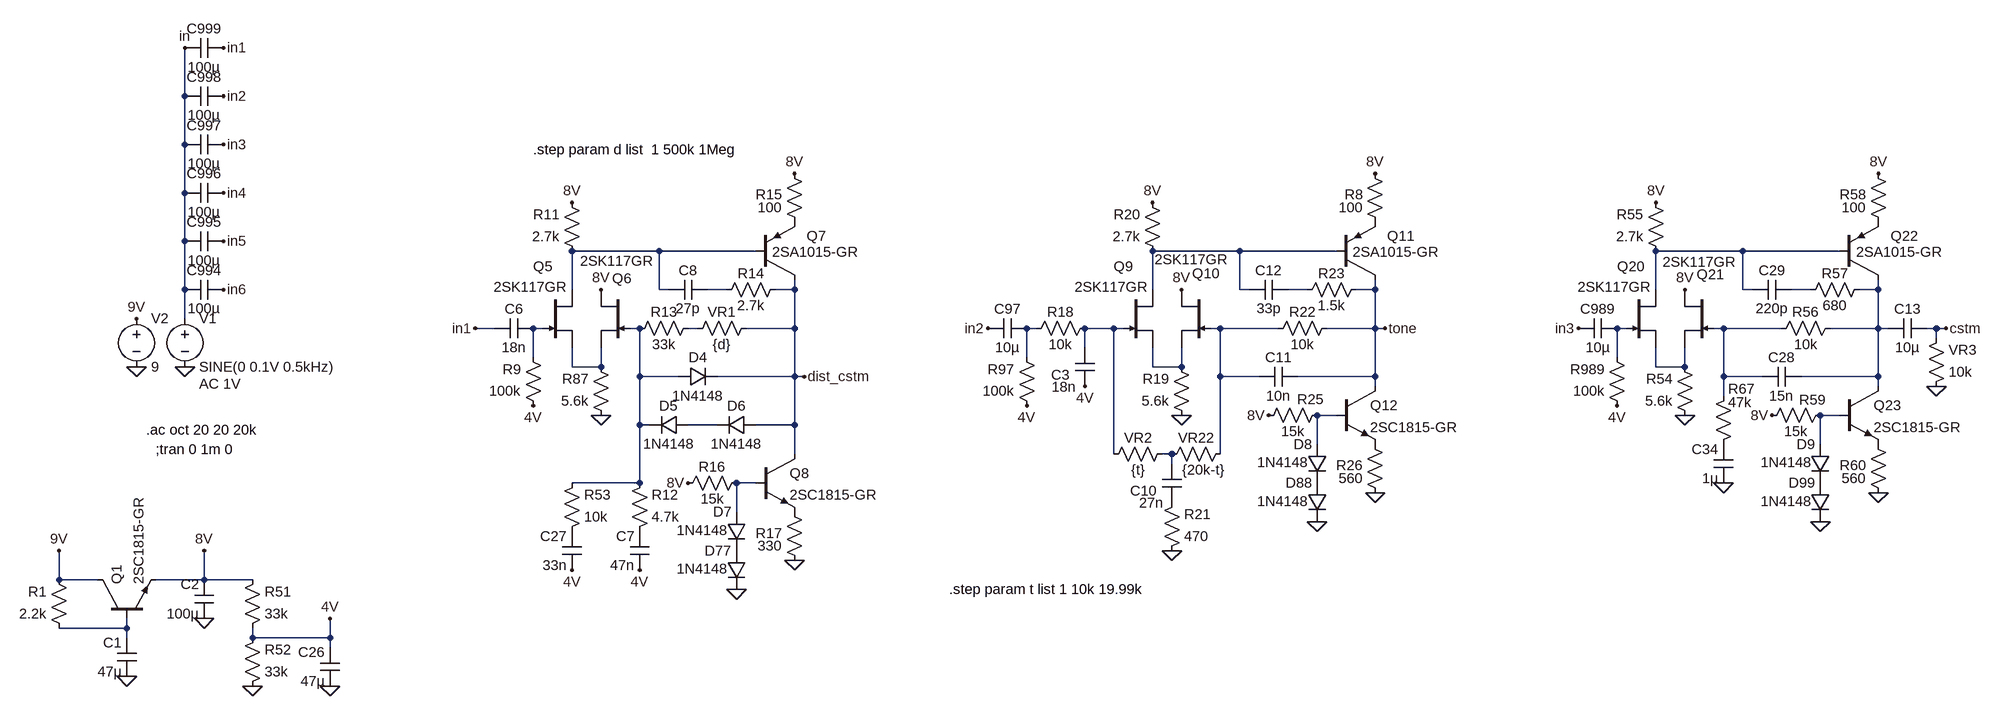
[diagram p0: schematic sd1w.asc]
sd1w.asc, the LTspice schematic file:
Version 4
SHEET 1 4260 4108
WIRE -2144 1024 -2144 944
WIRE -2144 1104 -2144 1024
WIRE -2144 1184 -2144 1104
WIRE -2144 1264 -2144 1184
WIRE -1360 1280 -1504 1280
WIRE -1200 1280 -1360 1280
WIRE -400 1280 -544 1280
WIRE -240 1280 -400 1280
WIRE 432 1280 288 1280
WIRE 592 1280 432 1280
WIRE -2144 1344 -2144 1264
WIRE -1504 1344 -1504 1280
WIRE -1360 1344 -1360 1280
WIRE -1344 1344 -1360 1344
WIRE -1248 1344 -1280 1344
WIRE -1136 1344 -1136 1328
WIRE -1136 1344 -1168 1344
WIRE -544 1344 -544 1280
WIRE -400 1344 -400 1280
WIRE -384 1344 -400 1344
WIRE -288 1344 -320 1344
WIRE -176 1344 -176 1328
WIRE -176 1344 -208 1344
WIRE 288 1344 288 1280
WIRE 432 1344 432 1280
WIRE 448 1344 432 1344
WIRE 544 1344 512 1344
WIRE 656 1344 656 1328
WIRE 656 1344 624 1344
WIRE -2144 1392 -2144 1344
WIRE -1632 1408 -1664 1408
WIRE -1552 1408 -1568 1408
WIRE -1392 1408 -1408 1408
WIRE -1296 1408 -1312 1408
WIRE -1136 1408 -1136 1344
WIRE -1136 1408 -1216 1408
WIRE -736 1408 -752 1408
WIRE -608 1408 -656 1408
WIRE -592 1408 -608 1408
WIRE -432 1408 -448 1408
WIRE -336 1408 -432 1408
WIRE -176 1408 -176 1344
WIRE -176 1408 -256 1408
WIRE -160 1408 -176 1408
WIRE 240 1408 224 1408
WIRE 400 1408 384 1408
WIRE 496 1408 400 1408
WIRE 656 1408 656 1344
WIRE 656 1408 576 1408
WIRE 672 1408 656 1408
WIRE 752 1408 736 1408
WIRE 768 1408 752 1408
WIRE 752 1424 752 1408
WIRE -656 1440 -656 1408
WIRE -1568 1456 -1568 1408
WIRE -752 1456 -752 1408
WIRE 224 1456 224 1408
WIRE -1504 1472 -1504 1440
WIRE -1456 1472 -1456 1440
WIRE -1456 1472 -1504 1472
WIRE -544 1472 -544 1440
WIRE -496 1472 -496 1440
WIRE -496 1472 -544 1472
WIRE 288 1472 288 1440
WIRE 336 1472 336 1440
WIRE 336 1472 288 1472
WIRE -1392 1488 -1392 1408
WIRE -1328 1488 -1392 1488
WIRE -1136 1488 -1136 1408
WIRE -1136 1488 -1264 1488
WIRE -1120 1488 -1136 1488
WIRE -432 1488 -432 1408
WIRE -368 1488 -432 1488
WIRE -176 1488 -176 1408
WIRE -176 1488 -304 1488
WIRE 400 1488 400 1408
WIRE 464 1488 400 1488
WIRE 656 1488 656 1408
WIRE 656 1488 528 1488
WIRE -176 1504 -176 1488
WIRE 656 1504 656 1488
WIRE 400 1520 400 1488
WIRE -240 1552 -272 1552
WIRE 592 1552 560 1552
WIRE -1392 1568 -1392 1488
WIRE -1376 1568 -1392 1568
WIRE -1264 1568 -1312 1568
WIRE -1136 1568 -1136 1488
WIRE -1136 1568 -1200 1568
WIRE -272 1600 -272 1552
WIRE 560 1600 560 1552
WIRE -1136 1616 -1136 1568
WIRE -608 1616 -608 1408
WIRE -512 1616 -528 1616
WIRE -432 1616 -432 1488
WIRE -512 1632 -512 1616
WIRE -1392 1664 -1392 1568
WIRE -1392 1664 -1504 1664
WIRE -1200 1664 -1232 1664
WIRE -1232 1712 -1232 1664
WIRE -2352 1824 -2352 1776
WIRE -2288 1824 -2352 1824
WIRE -2112 1824 -2112 1776
WIRE -2112 1824 -2192 1824
WIRE -2032 1824 -2112 1824
WIRE -2240 1904 -2240 1888
WIRE -2240 1904 -2352 1904
WIRE -2240 1920 -2240 1904
WIRE -2032 1920 -2032 1904
WIRE -1904 1920 -1904 1888
WIRE -1904 1920 -2032 1920
WIRE -1904 1936 -1904 1920
FLAG -2240 1984 0
FLAG -2112 1888 0
FLAG -2112 1776 8V
FLAG -2032 2000 0
FLAG -1904 2000 0
FLAG -1904 1888 4V
FLAG -2352 1776 9V
FLAG -1456 1552 0
FLAG -1568 1536 4V
FLAG -1456 1344 8V
FLAG -1504 1200 8V
FLAG -1136 1152 8V
FLAG -1664 1408 in1
FLAG -1312 1664 8V
FLAG -1232 1840 0
FLAG -1136 1792 0
FLAG -1392 1808 4V
FLAG -1504 1808 4V
FLAG -2144 1472 0
FLAG -2144 944 in
FLAG -2224 1472 0
FLAG -2224 1392 9V
FLAG -2080 944 in1
FLAG -2080 1024 in2
FLAG -2080 1104 in3
FLAG -2080 1184 in4
FLAG -2080 1264 in5
FLAG -2080 1344 in6
FLAG 336 1552 0
FLAG 224 1536 4V
FLAG 336 1344 8V
FLAG 288 1200 8V
FLAG 656 1152 8V
FLAG 480 1552 8V
FLAG 560 1728 0
FLAG 656 1680 0
FLAG 752 1504 0
FLAG 768 1408 cstm
FLAG 400 1664 0
FLAG -496 1552 0
FLAG -752 1536 4V
FLAG -496 1344 8V
FLAG -544 1200 8V
FLAG -176 1152 8V
FLAG -352 1552 8V
FLAG -272 1728 0
FLAG -176 1680 0
FLAG -512 1776 0
FLAG -656 1504 4V
FLAG -1120 1488 dist_cstm
FLAG -160 1408 tone
FLAG -816 1408 in2
FLAG 160 1408 in3
SYMBOL npn -2288 1888 R270
SYMATTR InstName Q1
SYMATTR Value 2SC1815-GR
SYMBOL res -2336 1920 R180
WINDOW 0 36 76 Left 2
WINDOW 3 36 40 Left 2
SYMATTR InstName R1
SYMATTR Value 2.2k
SYMBOL cap -2224 1984 R180
WINDOW 0 24 56 Left 2
WINDOW 3 24 8 Left 2
SYMATTR InstName C1
SYMATTR Value 47µ
SYMBOL cap -2096 1888 R180
WINDOW 0 24 56 Left 2
WINDOW 3 24 8 Left 2
SYMATTR InstName C2
SYMATTR Value 100µ
SYMBOL res -2048 1920 M180
WINDOW 0 36 76 Left 2
WINDOW 3 36 40 Left 2
SYMATTR InstName R51
SYMATTR Value 33k
SYMBOL res -2048 2016 M180
WINDOW 0 36 76 Left 2
WINDOW 3 36 40 Left 2
SYMATTR InstName R52
SYMATTR Value 33k
SYMBOL cap -1888 2000 R180
WINDOW 0 24 56 Left 2
WINDOW 3 24 8 Left 2
SYMATTR InstName C26
SYMATTR Value 47µ
SYMBOL res -1552 1552 R180
WINDOW 0 36 76 Left 2
WINDOW 3 36 40 Left 2
SYMATTR InstName R9
SYMATTR Value 100k
SYMBOL cap -1568 1392 R90
WINDOW 0 0 32 VBottom 2
WINDOW 3 32 32 VTop 2
SYMATTR InstName C6
SYMATTR Value 18n
SYMBOL res -1488 1296 R180
WINDOW 0 36 76 Left 2
WINDOW 3 36 40 Left 2
SYMATTR InstName R11
SYMATTR Value 2.7k
SYMBOL njf -1552 1344 R0
WINDOW 3 -81 -4 Left 2
WINDOW 0 -16 -38 Left 2
SYMATTR Value 2SK117GR
SYMATTR InstName Q5
SYMBOL njf -1408 1344 M0
WINDOW 0 -3 -18 Left 2
WINDOW 3 -39 -47 Left 2
SYMATTR InstName Q6
SYMATTR Value 2SK117GR
SYMBOL pnp -1200 1328 M180
WINDOW 0 84 73 Left 2
WINDOW 3 27 46 Left 2
SYMATTR InstName Q7
SYMATTR Value 2SA1015-GR
SYMBOL cap -1280 1328 R90
WINDOW 0 0 32 VBottom 2
WINDOW 3 32 32 VTop 2
SYMATTR InstName C8
SYMATTR Value 27p
SYMBOL res -1440 1568 R180
WINDOW 0 36 76 Left 2
WINDOW 3 36 40 Left 2
SYMATTR InstName R87
SYMATTR Value 5.6k
SYMBOL res -1152 1328 R90
WINDOW 0 5 56 VBottom 2
WINDOW 3 27 56 VTop 2
SYMATTR InstName R14
SYMATTR Value 2.7k
SYMBOL npn -1200 1616 R0
SYMATTR InstName Q8
SYMATTR Value 2SC1815-GR
SYMBOL res -1216 1648 R90
WINDOW 0 5 56 VBottom 2
WINDOW 3 27 56 VTop 2
SYMATTR InstName R16
SYMATTR Value 15k
SYMBOL diode -1216 1712 M0
WINDOW 3 30 30 Left 2
SYMATTR Value 1N4148
SYMATTR InstName D7
SYMBOL diode -1216 1776 M0
WINDOW 3 30 30 Left 2
SYMATTR Value 1N4148
SYMATTR InstName D77
SYMBOL res -1120 1808 R180
WINDOW 0 36 61 Left 2
WINDOW 3 36 40 Left 2
SYMATTR InstName R17
SYMATTR Value 330
SYMBOL res -1120 1248 R180
WINDOW 0 36 61 Left 2
WINDOW 3 36 40 Left 2
SYMATTR InstName R15
SYMATTR Value 100
SYMBOL cap -1376 1808 R180
WINDOW 0 24 56 Left 2
WINDOW 3 24 8 Left 2
SYMATTR InstName C7
SYMATTR Value 47n
SYMBOL res -1408 1760 M180
WINDOW 0 36 76 Left 2
WINDOW 3 36 40 Left 2
SYMATTR InstName R12
SYMATTR Value 4.7k
SYMBOL res -1200 1392 R90
WINDOW 0 5 56 VBottom 2
WINDOW 3 27 56 VTop 2
SYMATTR InstName VR1
SYMATTR Value {d}
SYMBOL res -1296 1392 R90
WINDOW 0 5 56 VBottom 2
WINDOW 3 27 56 VTop 2
SYMATTR InstName R13
SYMATTR Value 33k
SYMBOL diode -1328 1472 M90
WINDOW 0 0 32 VBottom 2
WINDOW 3 32 32 VTop 2
SYMATTR InstName D4
SYMATTR Value 1N4148
SYMBOL diode -1312 1552 R90
WINDOW 0 0 32 VBottom 2
WINDOW 3 32 32 VTop 2
SYMATTR InstName D5
SYMATTR Value 1N4148
SYMBOL diode -1200 1552 R90
WINDOW 0 0 32 VBottom 2
WINDOW 3 32 32 VTop 2
SYMATTR InstName D6
SYMATTR Value 1N4148
SYMBOL res -1520 1760 M180
WINDOW 0 36 76 Left 2
WINDOW 3 36 40 Left 2
SYMATTR InstName R53
SYMATTR Value 10k
SYMBOL cap -1488 1808 R180
WINDOW 0 24 56 Left 2
WINDOW 3 24 8 Left 2
SYMATTR InstName C27
SYMATTR Value 33n
SYMBOL voltage -2144 1376 R0
WINDOW 123 24 124 Left 2
WINDOW 39 0 0 Left 2
SYMATTR Value2 AC 1V
SYMATTR InstName V1
SYMATTR Value SINE(0 0.1V 0.5kHz)
SYMBOL voltage -2224 1376 R0
WINDOW 123 0 0 Left 0
WINDOW 39 0 0 Left 0
SYMATTR InstName V2
SYMATTR Value 9
SYMBOL cap -2080 1008 R90
WINDOW 0 0 32 VBottom 2
WINDOW 3 32 32 VTop 2
SYMATTR InstName C998
SYMATTR Value 100µ
SYMBOL cap -2080 1088 R90
WINDOW 0 0 32 VBottom 2
WINDOW 3 32 32 VTop 2
SYMATTR InstName C997
SYMATTR Value 100µ
SYMBOL cap -2080 1168 R90
WINDOW 0 0 32 VBottom 2
WINDOW 3 32 32 VTop 2
SYMATTR InstName C996
SYMATTR Value 100µ
SYMBOL cap -2080 928 R90
WINDOW 0 0 32 VBottom 2
WINDOW 3 32 32 VTop 2
SYMATTR InstName C999
SYMATTR Value 100µ
SYMBOL cap -2080 1248 R90
WINDOW 0 0 32 VBottom 2
WINDOW 3 32 32 VTop 2
SYMATTR InstName C995
SYMATTR Value 100µ
SYMBOL cap -2080 1328 R90
WINDOW 0 0 32 VBottom 2
WINDOW 3 32 32 VTop 2
SYMATTR InstName C994
SYMATTR Value 100µ
SYMBOL res 240 1552 R180
WINDOW 0 36 76 Left 2
WINDOW 3 36 40 Left 2
SYMATTR InstName R989
SYMATTR Value 100k
SYMBOL cap 224 1392 R90
WINDOW 0 0 32 VBottom 2
WINDOW 3 32 32 VTop 2
SYMATTR InstName C989
SYMATTR Value 10µ
SYMBOL res 304 1296 R180
WINDOW 0 36 76 Left 2
WINDOW 3 36 40 Left 2
SYMATTR InstName R55
SYMATTR Value 2.7k
SYMBOL njf 240 1344 R0
WINDOW 3 -81 -4 Left 2
WINDOW 0 -16 -38 Left 2
SYMATTR Value 2SK117GR
SYMATTR InstName Q20
SYMBOL njf 384 1344 M0
WINDOW 0 -17 -25 Left 2
WINDOW 3 -37 -46 Left 2
SYMATTR InstName Q21
SYMATTR Value 2SK117GR
SYMBOL pnp 592 1328 M180
WINDOW 0 84 73 Left 2
WINDOW 3 27 46 Left 2
SYMATTR InstName Q22
SYMATTR Value 2SA1015-GR
SYMBOL cap 512 1328 R90
WINDOW 0 0 32 VBottom 2
WINDOW 3 32 32 VTop 2
SYMATTR InstName C29
SYMATTR Value 220p
SYMBOL res 352 1568 R180
WINDOW 0 36 76 Left 2
WINDOW 3 36 40 Left 2
SYMATTR InstName R54
SYMATTR Value 5.6k
SYMBOL res 640 1328 R90
WINDOW 0 5 56 VBottom 2
WINDOW 3 27 56 VTop 2
SYMATTR InstName R57
SYMATTR Value 680
SYMBOL npn 592 1504 R0
SYMATTR InstName Q23
SYMATTR Value 2SC1815-GR
SYMBOL res 576 1536 R90
WINDOW 0 6 29 VBottom 2
WINDOW 3 27 56 VTop 2
SYMATTR InstName R59
SYMATTR Value 15k
SYMBOL diode 576 1600 M0
WINDOW 3 30 30 Left 2
SYMATTR Value 1N4148
SYMATTR InstName D9
SYMBOL diode 576 1664 M0
WINDOW 3 30 30 Left 2
SYMATTR Value 1N4148
SYMATTR InstName D99
SYMBOL res 672 1696 R180
WINDOW 0 36 61 Left 2
WINDOW 3 36 40 Left 2
SYMATTR InstName R60
SYMATTR Value 560
SYMBOL cap 736 1392 R90
WINDOW 0 0 32 VBottom 2
WINDOW 3 32 32 VTop 2
SYMATTR InstName C13
SYMATTR Value 10µ
SYMBOL res 736 1520 M180
WINDOW 0 36 76 Left 2
WINDOW 3 36 40 Left 2
SYMATTR InstName VR3
SYMATTR Value 10k
SYMBOL res 672 1248 R180
WINDOW 0 36 61 Left 2
WINDOW 3 36 40 Left 2
SYMATTR InstName R58
SYMATTR Value 100
SYMBOL cap 416 1664 R180
WINDOW 0 24 56 Left 2
WINDOW 3 24 8 Left 2
SYMATTR InstName C34
SYMATTR Value 1µ
SYMBOL res 384 1616 M180
WINDOW 0 24 108 Left 2
WINDOW 3 24 85 Left 2
SYMATTR InstName R67
SYMATTR Value 47k
SYMBOL res 592 1392 R90
WINDOW 0 5 56 VBottom 2
WINDOW 3 27 56 VTop 2
SYMATTR InstName R56
SYMATTR Value 10k
SYMBOL cap 528 1472 R90
WINDOW 0 0 32 VBottom 2
WINDOW 3 32 32 VTop 2
SYMATTR InstName C28
SYMATTR Value 15n
SYMBOL res -736 1552 R180
WINDOW 0 36 76 Left 2
WINDOW 3 36 40 Left 2
SYMATTR InstName R97
SYMATTR Value 100k
SYMBOL cap -752 1392 R90
WINDOW 0 0 32 VBottom 2
WINDOW 3 32 32 VTop 2
SYMATTR InstName C97
SYMATTR Value 10µ
SYMBOL res -528 1296 R180
WINDOW 0 36 76 Left 2
WINDOW 3 36 40 Left 2
SYMATTR InstName R20
SYMATTR Value 2.7k
SYMBOL njf -592 1344 R0
WINDOW 3 -81 -4 Left 2
WINDOW 0 -16 -38 Left 2
SYMATTR Value 2SK117GR
SYMATTR InstName Q9
SYMBOL njf -448 1344 M0
WINDOW 0 -15 -27 Left 2
WINDOW 3 -29 -50 Left 2
SYMATTR InstName Q10
SYMATTR Value 2SK117GR
SYMBOL pnp -240 1328 M180
WINDOW 0 84 73 Left 2
WINDOW 3 27 46 Left 2
SYMATTR InstName Q11
SYMATTR Value 2SA1015-GR
SYMBOL cap -320 1328 R90
WINDOW 0 0 32 VBottom 2
WINDOW 3 32 32 VTop 2
SYMATTR InstName C12
SYMATTR Value 33p
SYMBOL res -480 1568 R180
WINDOW 0 36 76 Left 2
WINDOW 3 36 40 Left 2
SYMATTR InstName R19
SYMATTR Value 5.6k
SYMBOL res -192 1328 R90
WINDOW 0 5 56 VBottom 2
WINDOW 3 27 56 VTop 2
SYMATTR InstName R23
SYMATTR Value 1.5k
SYMBOL npn -240 1504 R0
SYMATTR InstName Q12
SYMATTR Value 2SC1815-GR
SYMBOL res -256 1536 R90
WINDOW 0 5 27 VBottom 2
WINDOW 3 27 56 VTop 2
SYMATTR InstName R25
SYMATTR Value 15k
SYMBOL diode -256 1600 M0
WINDOW 3 30 30 Left 2
SYMATTR Value 1N4148
SYMATTR InstName D8
SYMBOL diode -256 1664 M0
WINDOW 3 30 30 Left 2
SYMATTR Value 1N4148
SYMATTR InstName D88
SYMBOL res -160 1696 R180
WINDOW 0 36 61 Left 2
WINDOW 3 36 40 Left 2
SYMATTR InstName R26
SYMATTR Value 560
SYMBOL res -160 1248 R180
WINDOW 0 36 61 Left 2
WINDOW 3 36 40 Left 2
SYMATTR InstName R8
SYMATTR Value 100
SYMBOL cap -496 1696 R180
WINDOW 0 41 19 Left 2
WINDOW 3 30 -1 Left 2
SYMATTR InstName C10
SYMATTR Value 27n
SYMBOL res -528 1792 M180
WINDOW 0 36 76 Left 2
WINDOW 3 36 40 Left 2
SYMATTR InstName R21
SYMATTR Value 470
SYMBOL res -240 1392 R90
WINDOW 0 5 56 VBottom 2
WINDOW 3 27 56 VTop 2
SYMATTR InstName R22
SYMATTR Value 10k
SYMBOL cap -304 1472 R90
WINDOW 0 0 32 VBottom 2
WINDOW 3 32 32 VTop 2
SYMATTR InstName C11
SYMATTR Value 10n
SYMBOL res -416 1600 R90
WINDOW 0 5 56 VBottom 2
WINDOW 3 27 44 VTop 2
SYMATTR InstName VR22
SYMATTR Value {20k-t}
SYMBOL res -512 1600 R90
WINDOW 0 5 56 VBottom 2
WINDOW 3 27 56 VTop 2
SYMATTR InstName VR2
SYMATTR Value {t}
SYMBOL cap -640 1504 R180
WINDOW 0 41 19 Left 2
WINDOW 3 30 -1 Left 2
SYMATTR InstName C3
SYMATTR Value 18n
SYMBOL res -640 1392 R90
WINDOW 0 5 56 VBottom 2
WINDOW 3 27 56 VTop 2
SYMATTR InstName R18
SYMATTR Value 10k
TEXT -2208 1576 Left 2 !.ac oct 20 20 20k
TEXT -2192 1608 Left 2 !;tran 0 1m 0
TEXT -1568 1112 Left 2 !.step param d list  1 500k 1Meg
TEXT -880 1840 Left 2 !.step param t list 1 10k 19.99k

The netlist it stands for:
* sd1w.asc
Q1 9V N024 8V 0 2SC1815-GR
R1 N024 9V 2.2k
C1 0 N024 47µ
C2 0 8V 100µ
R51 4V 8V 33k
R52 0 4V 33k
C26 0 4V 47µ
R9 4V N008 100k
C6 N008 in1 18n
R11 N001 8V 2.7k
J§Q5 N001 N008 N016 2SK117GR
J§Q6 8V N009 N016 2SK117GR
Q7 dist_cstm N001 P001 0 2SA1015-GR
C8 N004 N001 27p
R87 0 N016 5.6k
R14 dist_cstm N004 2.7k
Q8 dist_cstm N023 P002 0 2SC1815-GR
R16 N023 8V 15k
D7 N023 P003 1N4148
D77 P003 0 1N4148
R17 0 P002 330
R15 P001 8V 100
C7 4V P004 47n
R12 P004 N009 4.7k
R§VR1 dist_cstm N010 {d}
R13 N010 N009 33k
D4 N009 dist_cstm 1N4148
D5 N021 N009 1N4148
D6 dist_cstm N021 1N4148
R53 P005 N009 10k
C27 4V P005 33n
V1 in 0 SINE(0 0.1V 0.5kHz) AC 1V
V2 9V 0 9
C998 in2 in 100µ
C997 in3 in 100µ
C996 in4 in 100µ
C999 in1 in 100µ
C995 in5 in 100µ
C994 in6 in 100µ
R989 4V N014 100k
C989 N014 in3 10µ
R55 N003 8V 2.7k
J§Q20 N003 N014 N018 2SK117GR
J§Q21 8V N015 N018 2SK117GR
Q22 N007 N003 P006 0 2SA1015-GR
C29 N006 N003 220p
R54 0 N018 5.6k
R57 N007 N006 680
Q23 N007 N020 P007 0 2SC1815-GR
R59 N020 8V 15k
D9 N020 P008 1N4148
D99 P008 0 1N4148
R60 0 P007 560
C13 cstm N007 10µ
R§VR3 0 cstm 10k
R58 P006 8V 100
C34 0 P009 1µ
R67 P009 N015 47k
R56 N007 N015 10k
C28 N007 N015 15n
R97 4V N011 100k
C97 N011 in2 10µ
R20 N002 8V 2.7k
J§Q9 N002 N012 N017 2SK117GR
J§Q10 8V N013 N017 2SK117GR
Q11 tone N002 P010 0 2SA1015-GR
C12 N005 N002 33p
R19 0 N017 5.6k
R23 tone N005 1.5k
Q12 tone N019 P011 0 2SC1815-GR
R25 N019 8V 15k
D8 N019 P012 1N4148
D88 P012 0 1N4148
R26 0 P011 560
R8 P010 8V 100
C10 P013 N022 27n
R21 0 P013 470
R22 tone N013 10k
C11 tone N013 10n
R§VR22 N013 N022 {20k-t}
R§VR2 N022 N012 {t}
C3 4V N012 18n
R18 N012 N011 10k
.model D D
.lib standard.dio
.model NPN NPN
.model PNP PNP
.lib standard.bjt
.model NJF NJF
.model PJF PJF
.lib standard.jft
.ac oct 20 20 20k
;tran 0 1m 0
.step param d list  1 500k 1Meg
.step param t list 1 10k 19.99k
.backanno
.end